# Altium schematic sheet PSU_LT1962_4V8.SchDoc: 4.8V 300mA Power Supply
size A4; DocumentNumber: 9; Revision: 1; SheetNumber: 10; SheetTotal: 12; Organization: Altium Limited.; Address1: Level 3, 12a Rodborough Rd; Address2: Frenchs Forest 2086; Address3: NSW; Address4: AUSTRALIA
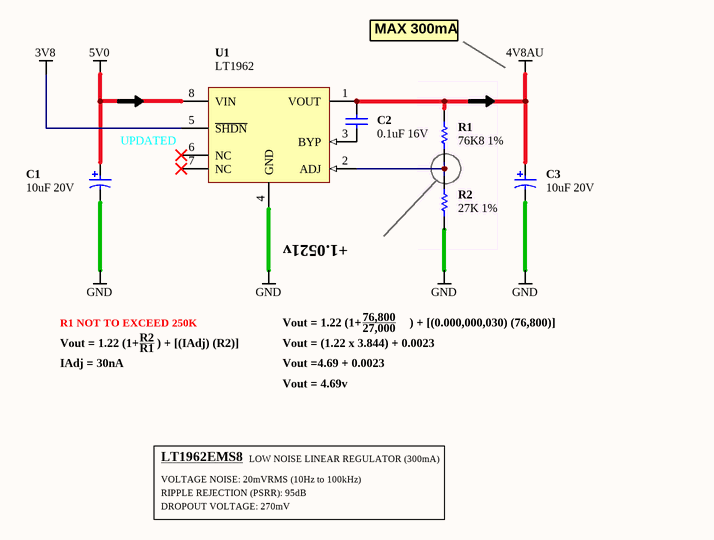
[diagram p0: PSU_LT1962_4V8.SchDoc]

## Parts
C1  10uF 20V  [CAPC3528-STAR]
C2  0.1uF 16V  [CAPC1005-STAR]
C3  10uF 20V  [CAPC3528-STAR]
R1  76K8 1%  [RESC1005-STAR]
R2  27K 1%  [RESC1005-STAR]
U1  LT1962  [TSOP65P490-8AN]

## Nets
3V8: U1.5(~{SHDN})
4V8AU: C2.2 C3.1 R1.1 U1.1(VOUT)
5V0: C1.1 U1.8(VIN)
GND: C1.2 C3.2 R2.2 U1.4(GND)
NetC2_1: C2.1 U1.3(BYP)
NetR1_2: R1.2 R2.1 U1.2(ADJ)

Not connected (* = marked no-connect by the designer): U1 6(NC)* 7(NC)*

## Notes on the sheet
- MAX 300mA
- UPDATED
- (near R2) +1.0521v
- Vout = 1.22 (1+      ) + [(IAdj) (R2)]
- R1 NOT TO EXCEED 250K
- R2
- Vout = 1.22 (1+                ) + [(0.000,000,030) (76,800)]
- Vout = (1.22 x 3.844) + 0.0023
- 76,800
- 27,000
- IAdj = 30nA
- R1
- Vout =4.69 + 0.0023
- Vout = 4.69v
- LT1962EMS8
- VOLTAGE NOISE: 20mVRMS (10Hz to 100kHz)
- LOW NOISE LINEAR REGULATOR (300mA)
- RIPPLE REJECTION (PSRR): 95dB
- DROPOUT VOLTAGE: 270mV
- Sheet Title
- Project Title
- Size:
- Date:
- A4
- Assy:
- Time:
- Revision:
- Sheet
- of
- File:

## Library data of the parts
C1 C3 = D-101-0007: Capacitor, Tantalum, 10uF 10% 20V MCCT-B (3528); Polarity: Polarized; Category: Capacitor; Capacitance: 10 uF; Mounting Technology: Surface Mount; Rated Voltage: 20 V; Status: Production; Technology: Tantalum; Tolerance: 10 %
C2 = D-101-0080: Capacitor, Ceramic, 0.1uF 10% 16V 0402 (1005) X7R; Manufactured Item Id: M-101-0099; Manufactured Item Id 1: M-101-0100; Polarity: Non-Polarized; Old Design Item Id: CAP-NP-0.1uF-16V-0805; Category: Capacitor; Capacitance: 0.1 uF; Dielectric: X7R; Mounting Technology: Surface Mount; Rated Voltage: 16 V; Status: Production; Technology: Ceramic; Tolerance: 10 %
R1 = D-100-0169: Resistor, 76K8 1% 0402 (1005); Power Rating: 63 mW; Resistance: 76.8 K; Category: Resistor; Mounting Technology: Surface Mount; Status: Unreleased; Tolerance: 1 %
R2 = D-100-0109: Resistor, 27K 1% 0402 (1005); Power Rating: 63 mW; Category: Resistor; Mounting Technology: Surface Mount; Resistance: 27 K; Status: Production; Tolerance: 1 %
U1 = D-204-0018: 300mA, Low Noise,  Micropower  LDO Regulators; Max Input Voltage: 20 V; Min Input Voltage: -20 V; Supply Voltage: -20 - +20 V; Status: Unreleased; Category: IC-Power; Mounting Technology: Surface Mount; Temperature Range: -40 to +85; Max Output Current: 300 mA; Max Output Voltage: 20 V; Min Output Voltage: -20 V